# EAGLE design monjolo (EAGLE 6.5.0)
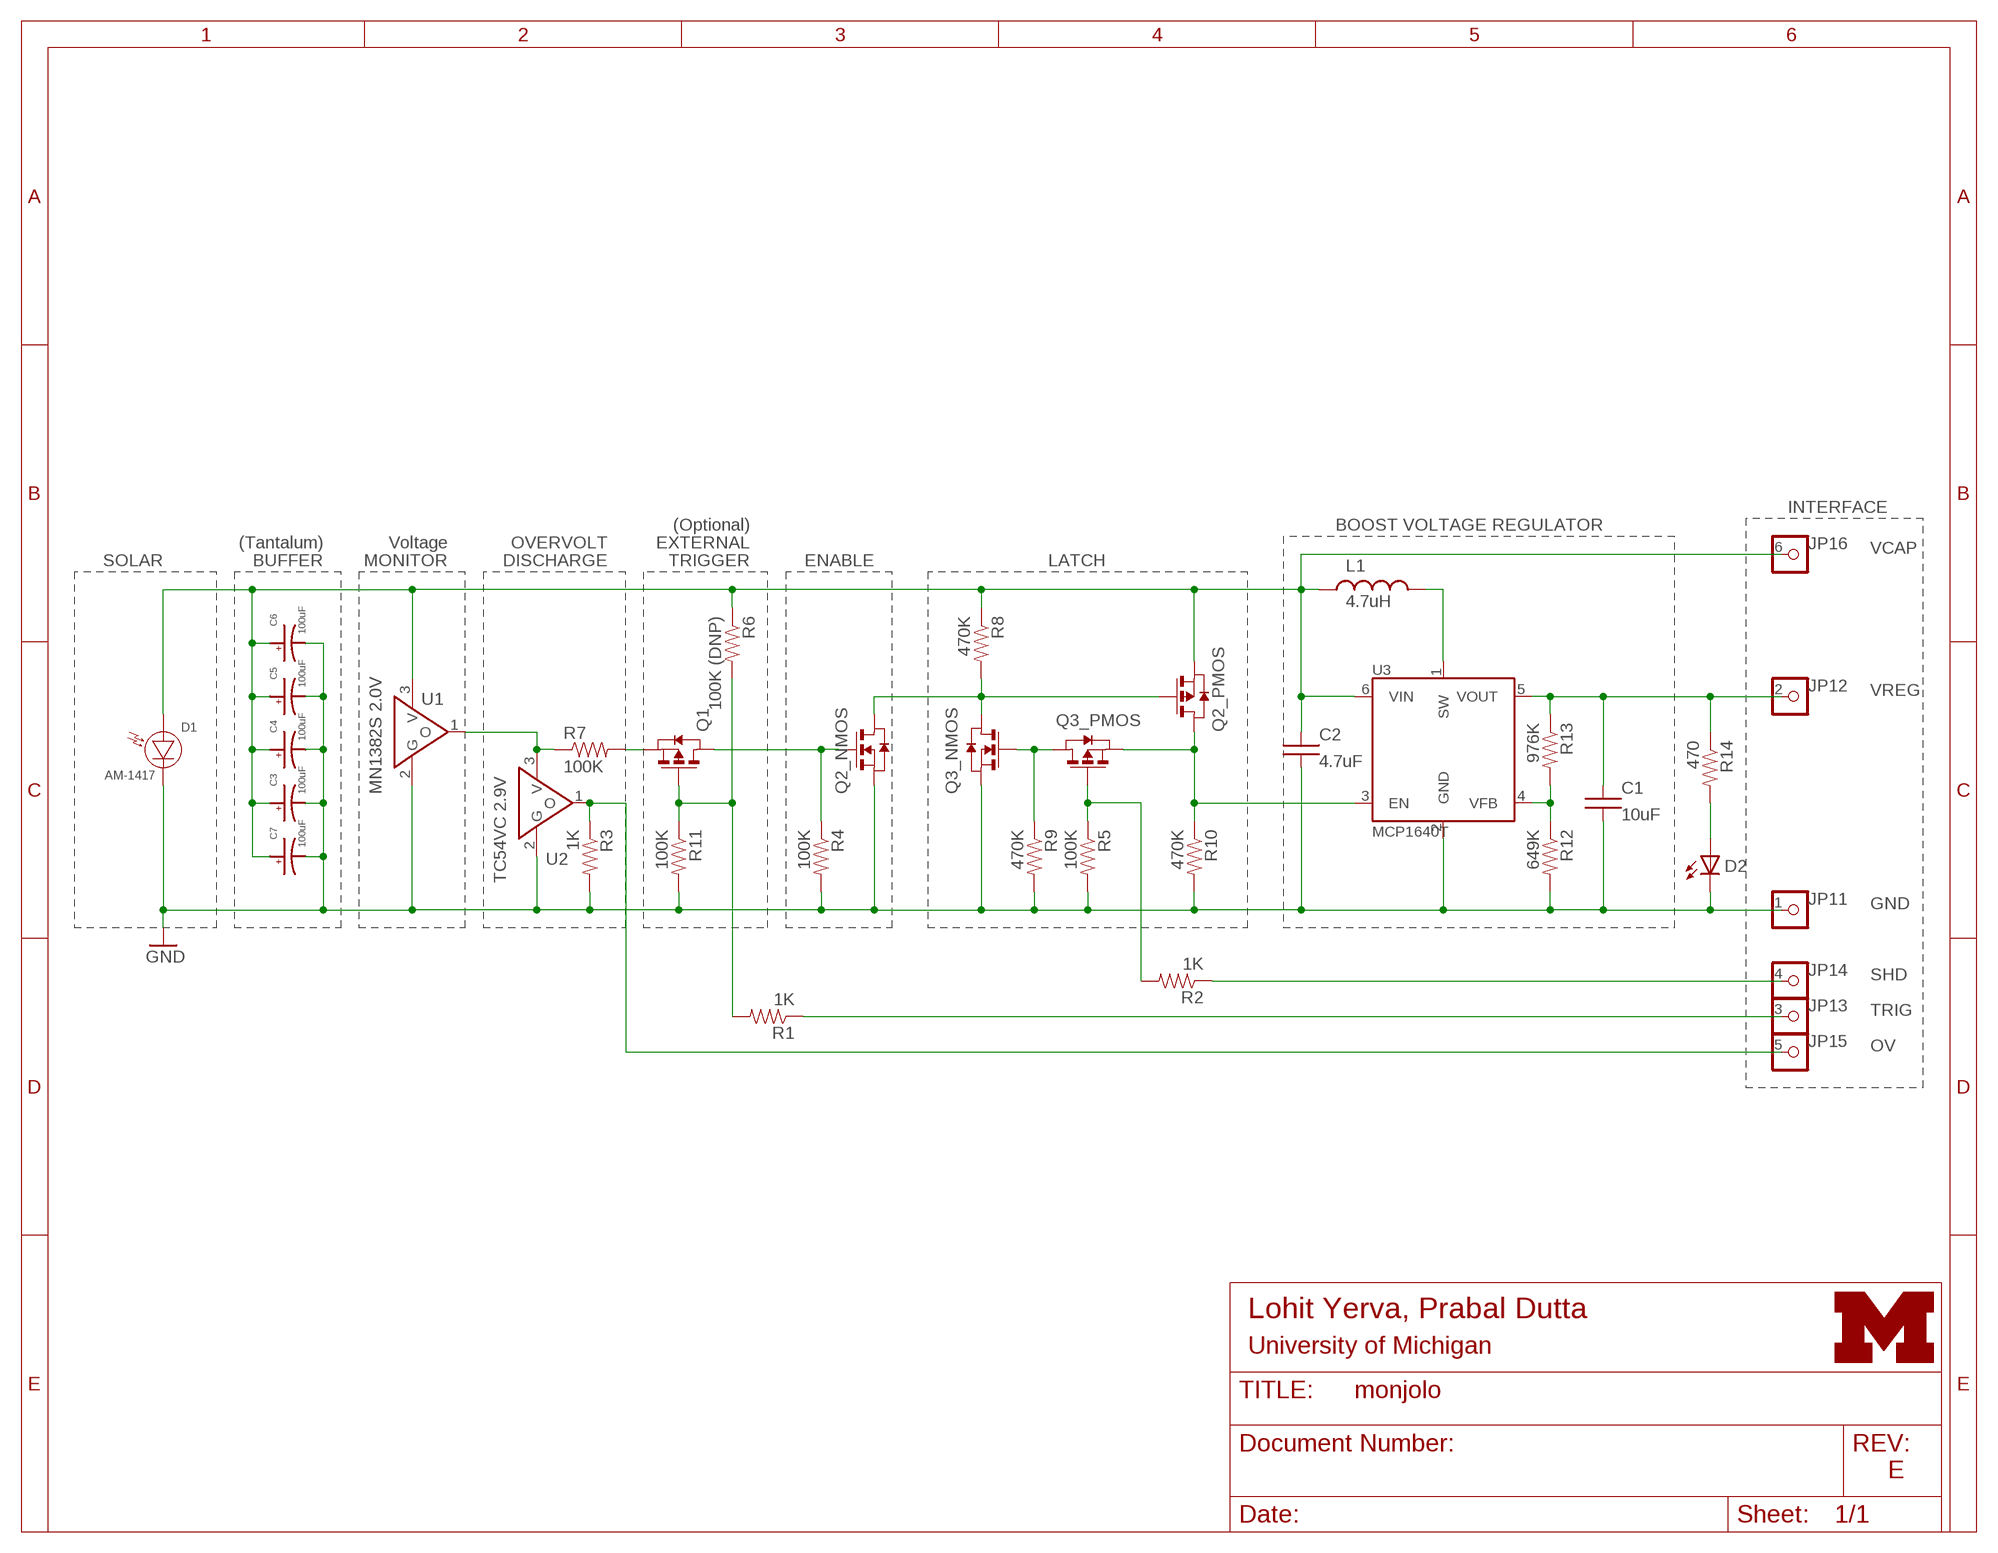
[diagram p0: schematic, sheet 1]

## Parts
C1  10uF  CAP  [R0603B]
C2  4.7uF  CAP  [R0603B]
C3  100uF  1210_CAP_POLARIZED  [CAP1210]
C4  100uF  1210_CAP_POLARIZED  [CAP1210]
C5  100uF  1210_CAP_POLARIZED  [CAP1210]
C6  100uF  1210_CAP_POLARIZED  [CAP1210]
C7  100uF  1210_CAP_POLARIZED  [CAP1210]
D1  AM-1417  [SANYO-AM-1417]
D2  LED0603  [LED-0603]
JP1  PINHD6  [HD6]
L1  4.7uH  L-US  [L2828]
Q1  PMOSSOT23  [SOT-23]
Q2  DUAL_MOSFET_NP  [TSOP-6]
Q3  DUAL_MOSFET_NP  [TSOP-6]
R1  1K  RESISTOR  [R0603B]
R2  1K  RESISTOR  [R0603B]
R3  1K  RESISTOR  [R0603B]
R4  100K  RESISTOR  [R0603B]
R5  100K  RESISTOR  [R0603B]
R6  100K (DNP)  RESISTOR  [R0603B]
R7  100K  RESISTOR  [R0603B]
R8  470K  RESISTOR  [R0603B]
R9  470K  RESISTOR  [R0603B]
R10  470K  RESISTOR  [R0603B]
R11  100K  RESISTOR  [R0603B]
R12  649K  RESISTOR  [R0603B]
R13  976K  RESISTOR  [R0603B]
R14  470  RESISTOR  [R0603B]
U1  MN1382S 2.0V  MN1382S  [MINI-3DC]
U2  TC54VC 2.9V  MN1382S  [MINI-3DC]
U3  MCP1640T  MCP1640  [SOT-23-6]
U$1  UMICH_SOLID_SMALL  [UMICH_SOLID_75MIL]

## Nets
GND: C1.2 C2.2 C3.ANODE C4.ANODE C5.ANODE C6.ANODE C7.ANODE D1.NEG(C) D2.C JP1.1 Q2.5(_NMOS:S) Q3.5(_NMOS:S) R3.2 R4.2 R5.2 R9.2 R10.2 R11.2 R12.2 U1.2(G) U2.2(G) U3.2(GND)
N$1: R12.1 R13.2 U3.4(VFB)
N$2: Q1.2(S) R7.2
N$3: JP1.3 R1.1
N$4: L1.2 U3.1(SW)
N$5: D2.A R14.2
N$6: Q3.1(_NMOS:G) Q3.4(_PMOS:D) R9.1
N$7: Q1.1(D) Q2.1(_NMOS:G) R4.1
N$8: JP1.4 R2.1
N$9: Q2.3(_PMOS:G) Q2.6(_NMOS:D) Q3.6(_NMOS:D) R8.2
N$12: Q3.3(_PMOS:G) R2.2 R5.1
N$13: JP1.5 R3.1 U2.1(O)
N$14: R7.1 U1.1(O) U2.3(V)
N$15: Q1.3(G) R1.2 R6.2 R11.1
N$18: Q2.4(_PMOS:D) Q3.2(_PMOS:S) R10.1 U3.3(EN)
VCAP: C2.1 C3.CATHODE C4.CATHODE C5.CATHODE C6.CATHODE C7.CATHODE D1.POS(A) JP1.6 L1.1 Q2.2(_PMOS:S) R6.1 R8.1 U1.3(V) U3.6(VIN)
VREG: C1.1 JP1.2 R13.1 R14.1 U3.5(VOUT)

## Notes on the sheet
- INTERFACE
- (Optional) | BOOST VOLTAGE REGULATOR
- (Tantalum) | Voltage | OVERVOLT | EXTERNAL
- SOLAR | BUFFER | MONITOR | DISCHARGE | TRIGGER | ENABLE | LATCH | VCAP
- VREG
- GND
- SHD
- TRIG
- OV
- Lohit Yerva, Prabal Dutta
- University of Michigan
- E

## Library data of the parts
C1 C2 = Gecko:CAP
C3-C7 = Gecko:1210_CAP_POLARIZED
D1 = Gecko:AM-1417
D2 = umich:LED: LEDs Standard schematic elements and footprints for 5mm, 3mm, 1206, and 0603 sized LEDs. 5mm - Spark Fun Electronics SKU : COM-00529 (and others)
JP1 = Gecko:PINHD6
L1 = Gecko:L-US
Q1 = berkeley-epic:PMOSSOT23: MOS FET
Q2 Q3 =  gecko_vreg_revC:DUAL_MOSFET_NP
R1-R14 = Gecko:RESISTOR
U1 U2 = umich:MN1382S
U3 = Gecko:MCP1640
U$1 = logos:UMICH_SOLID

## Board
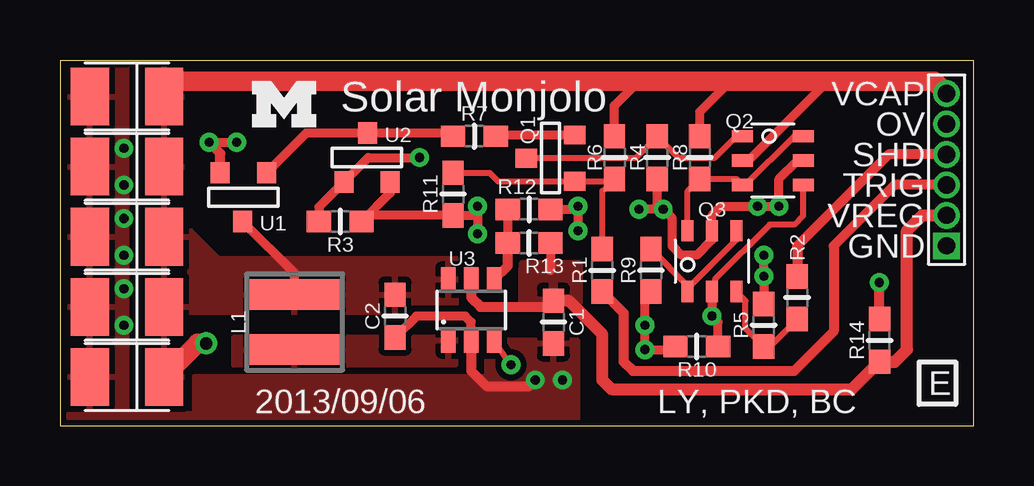
[diagram p1: board, top side]
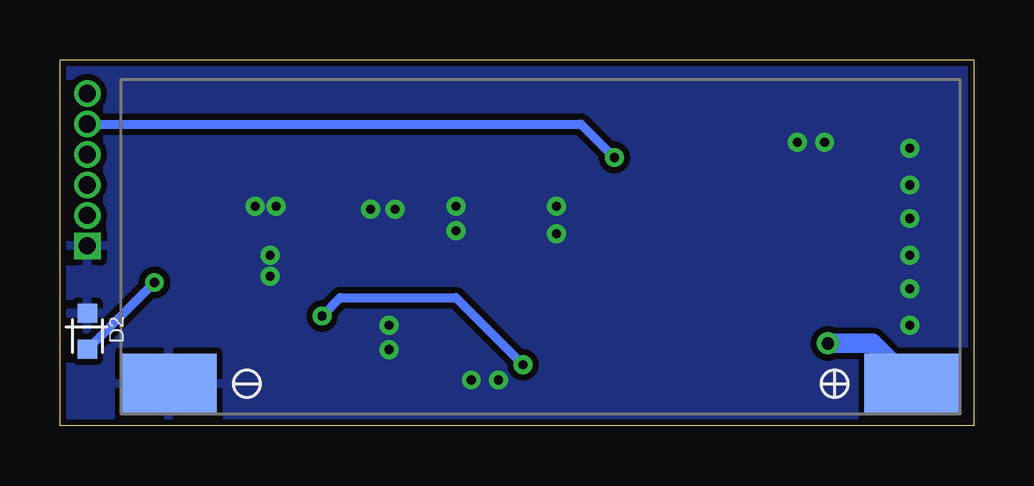
[diagram p2: board, bottom side, seen from below]

Size 38.1 x 15.24 mm. Coordinates in mm from the lower left corner, seen from the top.
Outline: 38.1,0 38.1,15.24 0,15.24 0,0 38.1,0
Copper layers (1*16): Top 0.0178mm / dielectric 59mil / Bottom 0.0178mm
Design rules "SSC-EAGLE-2Lyr_v1.0.0.3 *": minimum track width 6mil, minimum drill 14mil, track to track 6mil, track to pad 6mil, pad to pad 6mil, via to via 6mil, smd to smd 6mil, copper to edge 10mil, drill to drill 16mil, minimum pad ring 8mil, minimum via ring 8mil, stop-mask expansion 3mil, vias tented up to drill 20mil, thermal gap 10mil

### Footprints (pad centres in the part's own frame; a part is rotated, then mirrored left to right if it is on the bottom)
R0603B = smd 1.016 x 0.889: 1 -0.889,0; 2 0.889,0
CAP1210 = smd 2.4 x 1.6: ANODE 0,-1.55; CATHODE 0,1.55
SANYO-AM-1417 = smd 4 x 2.5: NEG 2,1.25; POS 33,1.25
LED-0603 = smd 0.8 x 0.8: A 0,-0.75; C 0,0.75
HD6 = drill 0.711 pad 1.016 square: 1 -2.54,0 | drill 0.711 pad 1.016: 2 -1.27,0; 3 0,0; 4 1.27,0; 5 2.54,0; 6 3.81,0
L2828 = smd 1.27 x 3.81: 1 -1.143,0; 2 1.143,0
SOT-23 = smd 0.787 x 0.889: 1 0.025,-1.016; 2 -0.94,1.016; 3 0.991,1.016
TSOP-6 = smd 0.508 x 0.889: 1 -1.016,-1.27; 2 0,-1.27; 3 1.016,-1.27; 4 1.016,1.27; 5 0,1.27; 6 -1.016,1.27
MINI-3DC = smd 0.787 x 0.889: 1 -0.991,-1.016; 2 0.94,-1.016; 3 0,1.016
SOT-23-6 = smd 0.61 x 1.016: 1 -0.953,-1.27; 2 0,-1.27; 3 0.953,-1.27; 4 0.953,1.27; 5 0,1.27; 6 -0.953,1.27

### Placement (x,y rotation side)
C1  20.57,4.32 270 top
C2  13.97,4.57 270 top
C3  2.79,10.79 270 top
C4  2.79,7.87 270 top
C5  2.79,4.95 270 top
C6  2.79,2.03 270 top
C7  2.79,13.72 270 top
D1  35.56,0.51 0 bottom
D2  36.96,3.94 0 bottom
JP1  36.96,10.03 90 top
L1  9.78,4.32 270 top
Q1  20.45,11.18 270 top
Q2  29.72,11.05 270 top
Q3  27.18,6.86 0 top
R1  22.61,6.48 90 top
R2  30.73,5.33 270 top
R3  11.68,8.51 0 top
R4  24.89,11.18 270 top
R5  29.34,4.19 90 top
R6  23.11,11.18 270 top
R7  17.27,12.06 0 top
R8  26.67,11.18 270 top
R9  24.64,6.48 270 top
R10  26.54,3.3 180 top
R11  16.38,9.65 270 top
R12  19.56,9.02 0 top
R13  19.56,7.62 180 top
R14  34.16,3.56 90 top
U1  7.62,9.53 180 top
U2  12.83,11.18 0 top
U3  17.14,4.83 0 top
U$1  8,12.45 0 top

### Tracks (layer width: path | path; a pad name or v marks a point on that pad's centre or on a via)
GND  (via drill 0.38)
  Top 0.381: v6.22,11.81 v7.37,11.81 | R12.2 21.46,9.02 v21.59,9.14 v21.59,8.13 | v25.15,9.02 v24.13,9.02 | R10.2 25.91,3.17 v24.38,3.17 v24.38,4.19 24.38,5.33 R9.2 | v17.4,9.14 v17.4,8 17.4,8.76 R11.2 12.83,8.76 R3.2 13.77,9.7 U2.2 | v29.34,7.11 v29.34,6.22 R5.2 | Q2.5 30.73,11.05 29.97,10.29 v29.97,9.14 v29.08,9.14 27.56,9.14 27.18,8.76 Q3.5 27.18,7.75 26.54,7.11 25.91,7.11 25.53,7.49 25.53,8.64 v25.15,9.02 | R4.2 24.89,9.27 v25.15,9.02 | U3.2 17.14,4.32 16.89,4.57 14.86,4.57 C2.2
  Top 0.406: U3.2 17.14,2.29 17.78,1.65 19.56,1.65 v19.81,1.91 | U1.2 6.68,11.35 v6.22,11.81
  other vias: 20.95,1.91 2.67,4.19 2.67,5.71 2.67,7.11 2.67,8.64 2.67,10.03 2.67,11.56
  pour Bottom (isolate 0.254): 0,0 0,15.24 38.1,15.24 38.1,0
  pour Top (isolate 0.254): 0,1.27 0,0 21.59,0 21.59,3.56 17.78,3.56 17.78,2.03 5.59,2.03 5.59,0.51 2.79,0.51 2.79,1.27
  pour Top (isolate 0.305): 2.79,15.11 0,15.24 0,0 2.79,0
N$1
  Top 0.381: R12.1 R13.2 18.73,7.87
  Top 0.406: U3.4 18.67,6.67 R13.2
N$2
  Top 0.381: R7.2 18.21,12.12 Q1.2
N$3
  Top 0.406: R1.1 23.5,4.7 23.5,2.67 23.88,2.29 30.61,2.29 32.26,3.94 32.26,7.49 34.8,10.03 JP1.3
N$4
  pour Top (isolate 0.254): 16.51,3.68 7.24,3.68 7.24,2.54 16.51,2.54
N$5  (via drill 0.38)
  Top 0.406: R14.2 v34.16,5.97
  Bottom 0.381: D2.A 36.95,3.19 v34.16,5.97
N$6
  Top 0.254: Q3.4 28.19,7.75 26.16,5.71 Q3.1 26.16,5.84 R9.1
N$7
  Top 0.254: Q1.1 19.46,11.18 24,11.18 R4.1 25.78,11.18 27.3,11.18 28.19,12.06 Q2.1
N$8
  Top 0.406: JP1.4 34.54,11.3 30.73,7.49 R2.1
N$9
  Top 0.254: Q2.6 30.61,12.06 28.57,10.03 Q2.3 28.19,10.29 R8.2 26.16,9.78 Q3.6
N$12
  Top 0.254: R2.2 29.59,3.3 R5.1 28.57,4.06 28.57,5.21 Q3.3
N$13  (via drill 0.38)
  Top 0.381: v14.99,11.18 12.85,11.18 U2.1 10.79,9.12 R3.1
  Bottom 0.381: JP1.5 16.38,12.57 v14.99,11.18
N$14
  Top 0.381: R7.1 16.26,12.19 U2.3 10.26,12.19 U1.1
N$15
  Top 0.254: R11.1 17.91,10.54 18.26,10.19 Q1.3 23.14,10.19 R6.2 22.61,9.78 R1.2
N$18  (via drill 0.38)
  Top 0.254: U3.3 18.73,2.6 v18.8,2.54 | Q2.4 30.99,8.76 30.61,8.38 29.59,8.38 27.3,6.1 27.3,5.71 Q3.2
  Top 0.381: R10.1 27.43,4.32 v27.18,4.57 Q3.2
  Bottom 0.381: v27.18,4.57 26.42,5.33 21.59,5.33 v18.8,2.54
VCAP  (via drill 0.51)
  Top 0.381: L1.1 9.78,6.35 U1.3 | R6.1 23.11,13.34 24.13,14.35 | R8.1 26.67,13.08 27.94,14.35 | Q2.2 28.7,11.05 32,14.35 33.02,14.35
  Top 0.813: JP1.6 36.45,14.35 33.02,14.35 27.94,14.35 24.13,14.35 4.98,14.35 C7.CATHODE | v6.1,3.43 5.74,3.43 C6.CATHODE
  Bottom 0.813: D1.POS 4.23,3.43 v6.1,3.43
  pour Top (isolate 0.254): 5.08,8.51 6.6,6.99 16.51,6.99 16.51,4.7 5.08,4.7 5.08,1.02 3.68,1.02 3.68,15.11 5.08,15.24
VREG
  Top 0.381: R13.1 20.45,6.48
  Top 0.406: U3.5 17.14,5.33 17.53,4.95 20.32,4.95 C1.1
  Top 0.508: C1.1 21.21,5.21 22.61,3.81 22.61,1.91 22.99,1.52 33.02,1.52 R14.1 34.8,2.67 35.31,3.17 35.31,8.13 35.94,8.76 JP1.2
  pour Top (isolate 0.254): 19.3,6.73 21.59,6.73 21.59,5.08 19.3,5.08

### Text on the board
tPlace: VCAP | Solar Monjolo | OV | SHD | TRIG | VREG | GND | 2013/09/06 | LY, PKD, BC | E
tValues: VCAP | N_P_MOS | OV | PMOS | SHD | TRIG | N_P_MOS | GND | VREG